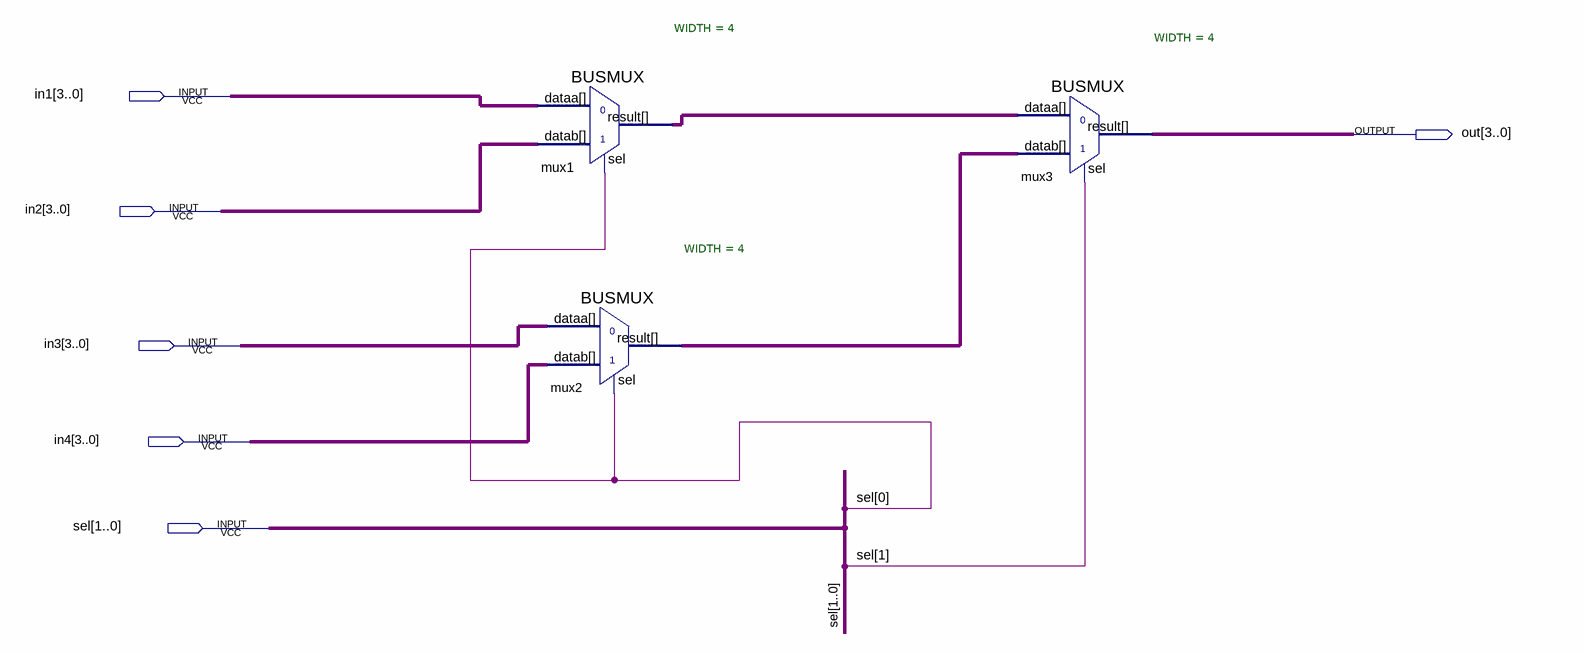
[diagram p0: schematic sheet]
// Quartus schematic muxfourbit.bdf as structural Verilog: 3 symbols, 6 pins
module muxfourbit (
  input  [3:0] in1,
  input  [3:0] in2,
  input  [3:0] in3,
  input  [3:0] in4,
  input  [1:0] sel,
  output [3:0] out
);

  wire [3:0] mux1_result, mux2_result;

  BUSMUX #(.WIDTH(4)) mux1 (.datab(in2), .sel(sel[0]), .dataa(in1), .result(mux1_result));
  BUSMUX #(.WIDTH(4)) mux2 (.datab(in4), .sel(sel[0]), .dataa(in3), .result(mux2_result));
  BUSMUX #(.WIDTH(4)) mux3 (.datab(mux2_result), .sel(sel[1]), .dataa(mux1_result), .result(out));
endmodule
